# Altium schematic sheet MCU.SchDoc
size A
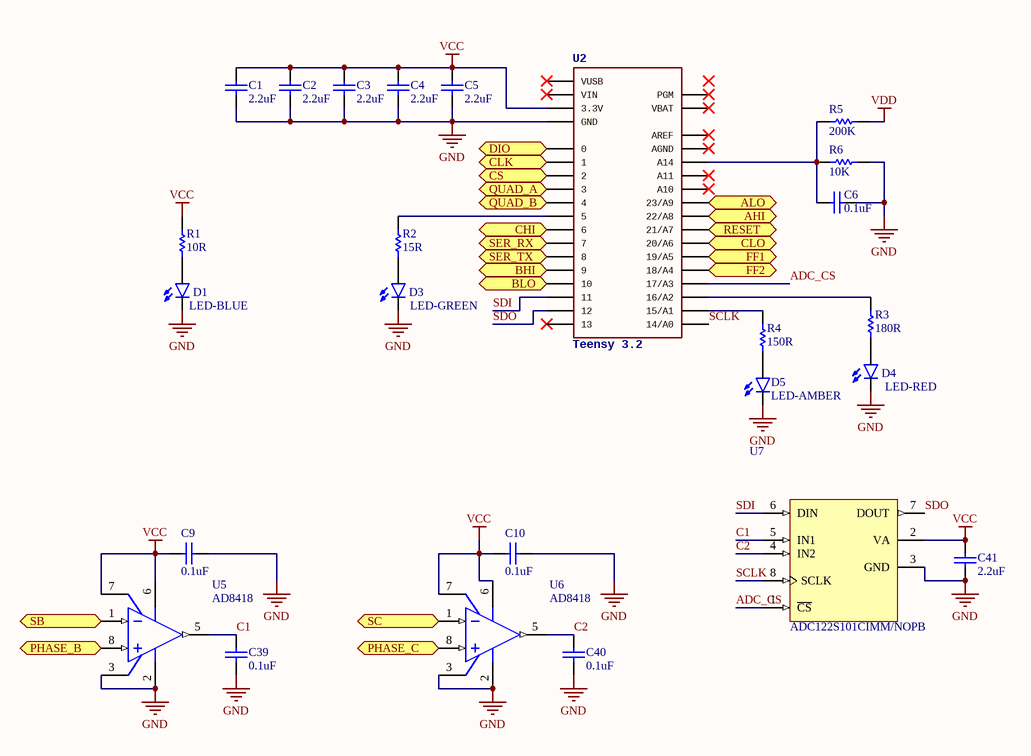
[diagram p0: MCU.SchDoc]

## Parts
C1  2.2uF  [CAPC0603(1608)55_N]
C2  2.2uF  [CAPC0603(1608)55_N]
C3  2.2uF  [CAPC0603(1608)55_N]
C4  2.2uF  [CAPC0603(1608)55_N]
C5  2.2uF  [CAPC0603(1608)55_N]
C6  0.1uF  [CAPC0603(1608)100_L]
C9  0.1uF  [CAPC0603(1608)100_L]
C10  0.1uF  [CAPC0603(1608)100_L]
C39  0.1uF  [CAPC0603(1608)100_M]
C40  0.1uF  [CAPC0603(1608)100_M]
C41  2.2uF  [CAPC0603(1608)100_L]
D1  LED-BLUE  [LED-1206]
D3  LED-GREEN  [LED-1206]
D4  LED-RED  [LED-1206]
D5  LED-AMBER  [LED-1206]
R1  10R  [RESC0603(1608)_N]
R2  15R  [RESC0603(1608)_N]
R3  180R  [RESC0603(1608)_N]
R4  150R  [RESC0603(1608)_N]
R5  200K  [RESC0603(1608)_N]
R6  10K  [RESC0603(1608)_N]
U2  Teensy 3.2  [TEENSY_3.0+4]
U5  AD8418  [MSOP-8]
U6  AD8418  [MSOP-8]
U7  ADC122S101CIMM/NOPB  [MUA08A_L]

## Ports
AHI (out), ALO (out), BHI (out), BLO (out), CHI (out), CLK (out), CLO (out), CS (out), DIO (in), FF1 (in), FF2 (in), PHASE_B (in), PHASE_C (in), QUAD_A (in), QUAD_B (in), RESET (out), SB (in), SC (in), SER_RX (in), SER_TX (in)

## Nets
GND: C1.1 C2.1 C3.1 C4.1 C5.1 C6.2 C9.1 C10.1 C39.1 C40.1 C41.1 D1.C D3.C D4.C D5.C R6.2 U2.GND_GND1(GND) U5.2(GND) U5.3(VREF2) U6.2(GND) U6.3(VREF2) U7.3(GND)
VCC: C1.2 C2.2 C3.2 C4.2 C5.2 C9.2 C10.2 C41.2 R1.2 U2.3.3V_3.3V1(3.3V) U5.6(VS) U5.7(VREF1) U6.6(VS) U6.7(VREF1) U7.2(VA)
VDD: R5.2
ADC_CS: U2.17/A3 U7.1(~{CS})
AHI: U2.22/A8 ; port AHI
ALO: U2.23/A9 ; port ALO
BHI: U2.9 ; port BHI
BLO: U2.10 ; port BLO
C1: C39.2 U5.5(OUT) U7.5(IN1)
C2: C40.2 U6.5(OUT) U7.4(IN2)
CHI: U2.6 ; port CHI
CLK: U2.1 ; port CLK
CLO: U2.20/A6 ; port CLO
CS: U2.2 ; port CS
DIO: U2.0 ; port DIO
FF1: U2.19/A5 ; port FF1
FF2: U2.18/A4 ; port FF2
PHASE_B: U5.8(IN+) ; port PHASE_B
PHASE_C: U6.8(IN+) ; port PHASE_C
QUAD_A: U2.3 ; port QUAD_A
QUAD_B: U2.4 ; port QUAD_B
RESET: U2.21/A7 ; port RESET
SB: U5.1(IN-) ; port SB
SC: U6.1(IN-) ; port SC
SCLK: U2.14/A0 U7.8(SCLK)
SDI: U2.11 U7.6(DIN)
SDO: U2.12 U7.7(DOUT)
SER_RX: U2.7 ; port SER_RX
SER_TX: U2.8 ; port SER_TX
NetC6_1: C6.1 R5.1 R6.1 U2.A14
NetD1_A: D1.A R1.1
NetD3_A: D3.A R2.1
NetD4_A: D4.A R3.1
NetD5_A: D5.A R4.1
NetR2_2: R2.2 U2.5
NetR3_2: R3.2 U2.16/A2
NetR4_2: R4.2 U2.15/A1

Not connected (* = marked no-connect by the designer): U2 13* A10* A11* AGND* AREF* PGM* VBAT* VIN* VUSB*

## Library data of the parts
C1-C5 = CMP-1035-02762-1: CAP 2.2uF 16V Â±10% 0603 (1608 Metric) Thickness 0.55mm SMD; Case-EIA: 0603; Case-Metric: 1608; Max Thickness: 0.55 mm; Technology: SMT; Value: 2.2uF; Rated Voltage: 16 V; Tolerance: Â±10%
C6 = CMP-1035-02591-1: CAP 100nF 50V Â±5% 0603 (1608 Metric) Thickness 1mm SMD; Case-Metric: 1608; Case-EIA: 0603; Rated Voltage: 50 V; Max Thickness: 1 mm; Tolerance: Â±5%; Technology: SMT; Value: 100nF
C9 C10 = CMP-1035-02577-1: CAP 100nF 6.3V Â±20% 0603 (1608 Metric) Thickness 1mm SMD; Case-EIA: 0603; Case-Metric: 1608; Technology: SMT; Rated Voltage: 6.3 V; Value: 100nF; Max Thickness: 1 mm; Tolerance: Â±20%
C39 C40 = CMP-1035-02575-1: CAP 100nF 6.3V ±5% 0603 (1608 Metric) Thickness 1mm SMD; Tolerance: Â±5%; Case-Metric: 1608; Case-EIA: 0603; Technology: SMT; Rated Voltage: 6.3 V; Max Thickness: 1 mm; Value: 100nF
C41 = CMP-1035-02754-1: CAP 2.2uF 6.3V ±10% 0603 (1608 Metric) Thickness 1mm SMD; Case-EIA: 0603; Tolerance: Â±10%; Case-Metric: 1608; Technology: SMT; Value: 2.2uF; Rated Voltage: 6.3 V; Max Thickness: 1 mm
D1 = LED-BLUE1206: PROD_ID: DIO-09911
D3 = LED-GREEN1206: PROD_ID: DIO-00862
D4 = LED-RED1206: PROD_ID: DIO-09912
D5 = LED-AMBER1206
R1 = CMP-1012-00026-1: 10R 0.1W 5% 0603 (1608 Metric)  SMD; Case-Metric: 1608; Case-EIA: 0603; Value: 10.00 Ohm; Technology: SMT; Tolerance: 5 %; Power: 0.1 W
R2 = CMP-1012-00030-1: 15R 0.1W 5% 0603 (1608 Metric)  SMD; Case-EIA: 0603; Case-Metric: 1608; Value: 15.00 Ohm; Tolerance: 5 %; Technology: SMT; Power: 0.1 W
R3 = CMP-1012-00056-1: 180R 0.1W 5% 0603 (1608 Metric)  SMD; Value: 180.00 Ohm; Case-EIA: 0603; Case-Metric: 1608; Power: 0.1 W; Technology: SMT; Tolerance: 5 %
R4 = CMP-1012-00054-1: 150R 0.1W 5% 0603 (1608 Metric)  SMD; Case-EIA: 0603; Value: 150.00 Ohm; Case-Metric: 1608; Power: 0.1 W; Tolerance: 5 %; Technology: SMT
R5 = CMP-1012-00129-1: 200K 0.1W 5% 0603 (1608 Metric)  SMD; Case-EIA: 0603; Value: 200000.00 Ohm; Case-Metric: 1608; Technology: SMT; Power: 0.1 W; Tolerance: 5 %
R6 = CMP-1012-00098-1: 10K 0.1W 5% 0603 (1608 Metric)  SMD; Case-EIA: 0603; Value: 10000.00 Ohm; Case-Metric: 1608; Technology: SMT; Tolerance: 5 %; Power: 0.1 W
U2 = TEENSY_3.0+4: pin to pad: 3.3V 3.3V1>3.3V+3.3V1 GND GND1>GND+GND1
U7 = CMP-0054-00398-2: 2 Channel, 500 kSPS to 1 MSPS 12-Bit A/D Converter, 8-pin Mini SOIC, Pb-Free; Manufacturer: National Semiconductor; CompType: ADC IC; PackageTopMarking: ZXTT*X24C; PowerWise: Y; ComponentLink1URL: http://www.national.com/ds/AD/ADC122S101.pdf; RoHS: Y; Code_JEDEC: MO-187-AA; RevisionNote: Component URLs added; PinCount: 8; PackageVersion: revF, Apr-2008; ComponentLink2URL: http://www.national.com/pf/AD/ADC122S101.html; ComponentLink3Description: MUA08A Package Page; ComponentLink3URL: http://www.national.com/packaging/folders/mua08a.html; PackageReference: MUA08A; PackageDescription: MINI SOIC, .118 x .118 x .034in, 8 Lead, .0256in Pitch; ComponentLink1Description: ADC122S101 Datasheet; ComponentLink2Description: ADC122S101 Web Page; DatasheetVersion: Jan-2010